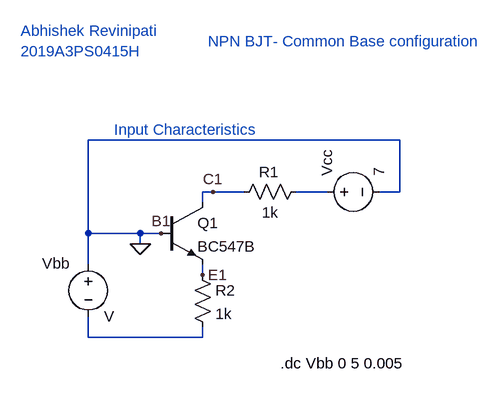
[diagram p0: schematic 2019A3PS0415_CB1.asc]
2019A3PS0415_CB1.asc, the LTspice schematic file:
Version 4
SHEET 1 1332 680
WIRE 688 96 208 96
WIRE 400 176 384 176
WIRE 448 176 400 176
WIRE 576 176 528 176
WIRE 688 176 688 96
WIRE 688 176 656 176
WIRE 384 192 384 176
WIRE 208 240 208 96
WIRE 288 240 208 240
WIRE 320 240 288 240
WIRE 288 256 288 240
WIRE 208 288 208 240
WIRE 384 304 384 288
WIRE 208 400 208 368
WIRE 384 400 384 384
WIRE 384 400 208 400
FLAG 288 256 0
FLAG 400 176 C1
FLAG 320 240 B1
FLAG 384 304 E1
SYMBOL npn 320 192 R0
SYMATTR InstName Q1
SYMATTR Value BC547B
SYMBOL voltage 560 176 R270
WINDOW 123 0 0 Left 2
WINDOW 39 0 0 Left 2
SYMATTR InstName Vcc
SYMATTR Value 7
SYMBOL voltage 208 272 R0
WINDOW 123 0 0 Left 2
WINDOW 39 0 0 Left 2
WINDOW 0 -71 14 Left 2
SYMATTR InstName Vbb
SYMBOL res 544 160 R90
WINDOW 0 1 58 VBottom 2
WINDOW 3 32 56 VTop 2
SYMATTR InstName R1
SYMATTR Value 1k
SYMBOL res 368 288 R0
SYMATTR InstName R2
SYMATTR Value 1k
TEXT 392 -56 Left 2 ;NPN BJT- Common Base configuration
TEXT 248 80 Left 2 ;Input Characteristics
TEXT 504 440 Left 2 !.dc Vbb 0 5 0.005
TEXT 104 -72 Left 2 ;Abhishek Revinipati\n2019A3PS0415H

The netlist it stands for:
* 2019A3PS0415_CB1.asc
Q1 C1 0 E1 0 BC547B
Vcc N001 0 7
Vbb 0 N002 V
R1 N001 C1 1k
R2 E1 N002 1k
.model NPN NPN
.model PNP PNP
.lib standard.bjt
* NPN BJT- Common Base configuration
* Input Characteristics
.dc Vbb 0 5 0.005
* Abhishek Revinipati
* 2019A3PS0415H
.backanno
.end